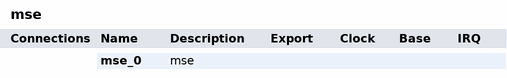
[diagram p0: system contents]
# Platform Designer (Qsys) system mse, MAX II EPM1270T144C5
# Parameters at their usual value, and those the tool derives, are not listed.
package require qsys
create_system mse
set_project_property DEVICE_FAMILY {MAX II}
set_project_property DEVICE EPM1270T144C5

add_instance mse_0 mse 1.0

save_system mse.qsys
